# EAGLE schematic DQ542MA ESP32 (EAGLE 9.4.2)
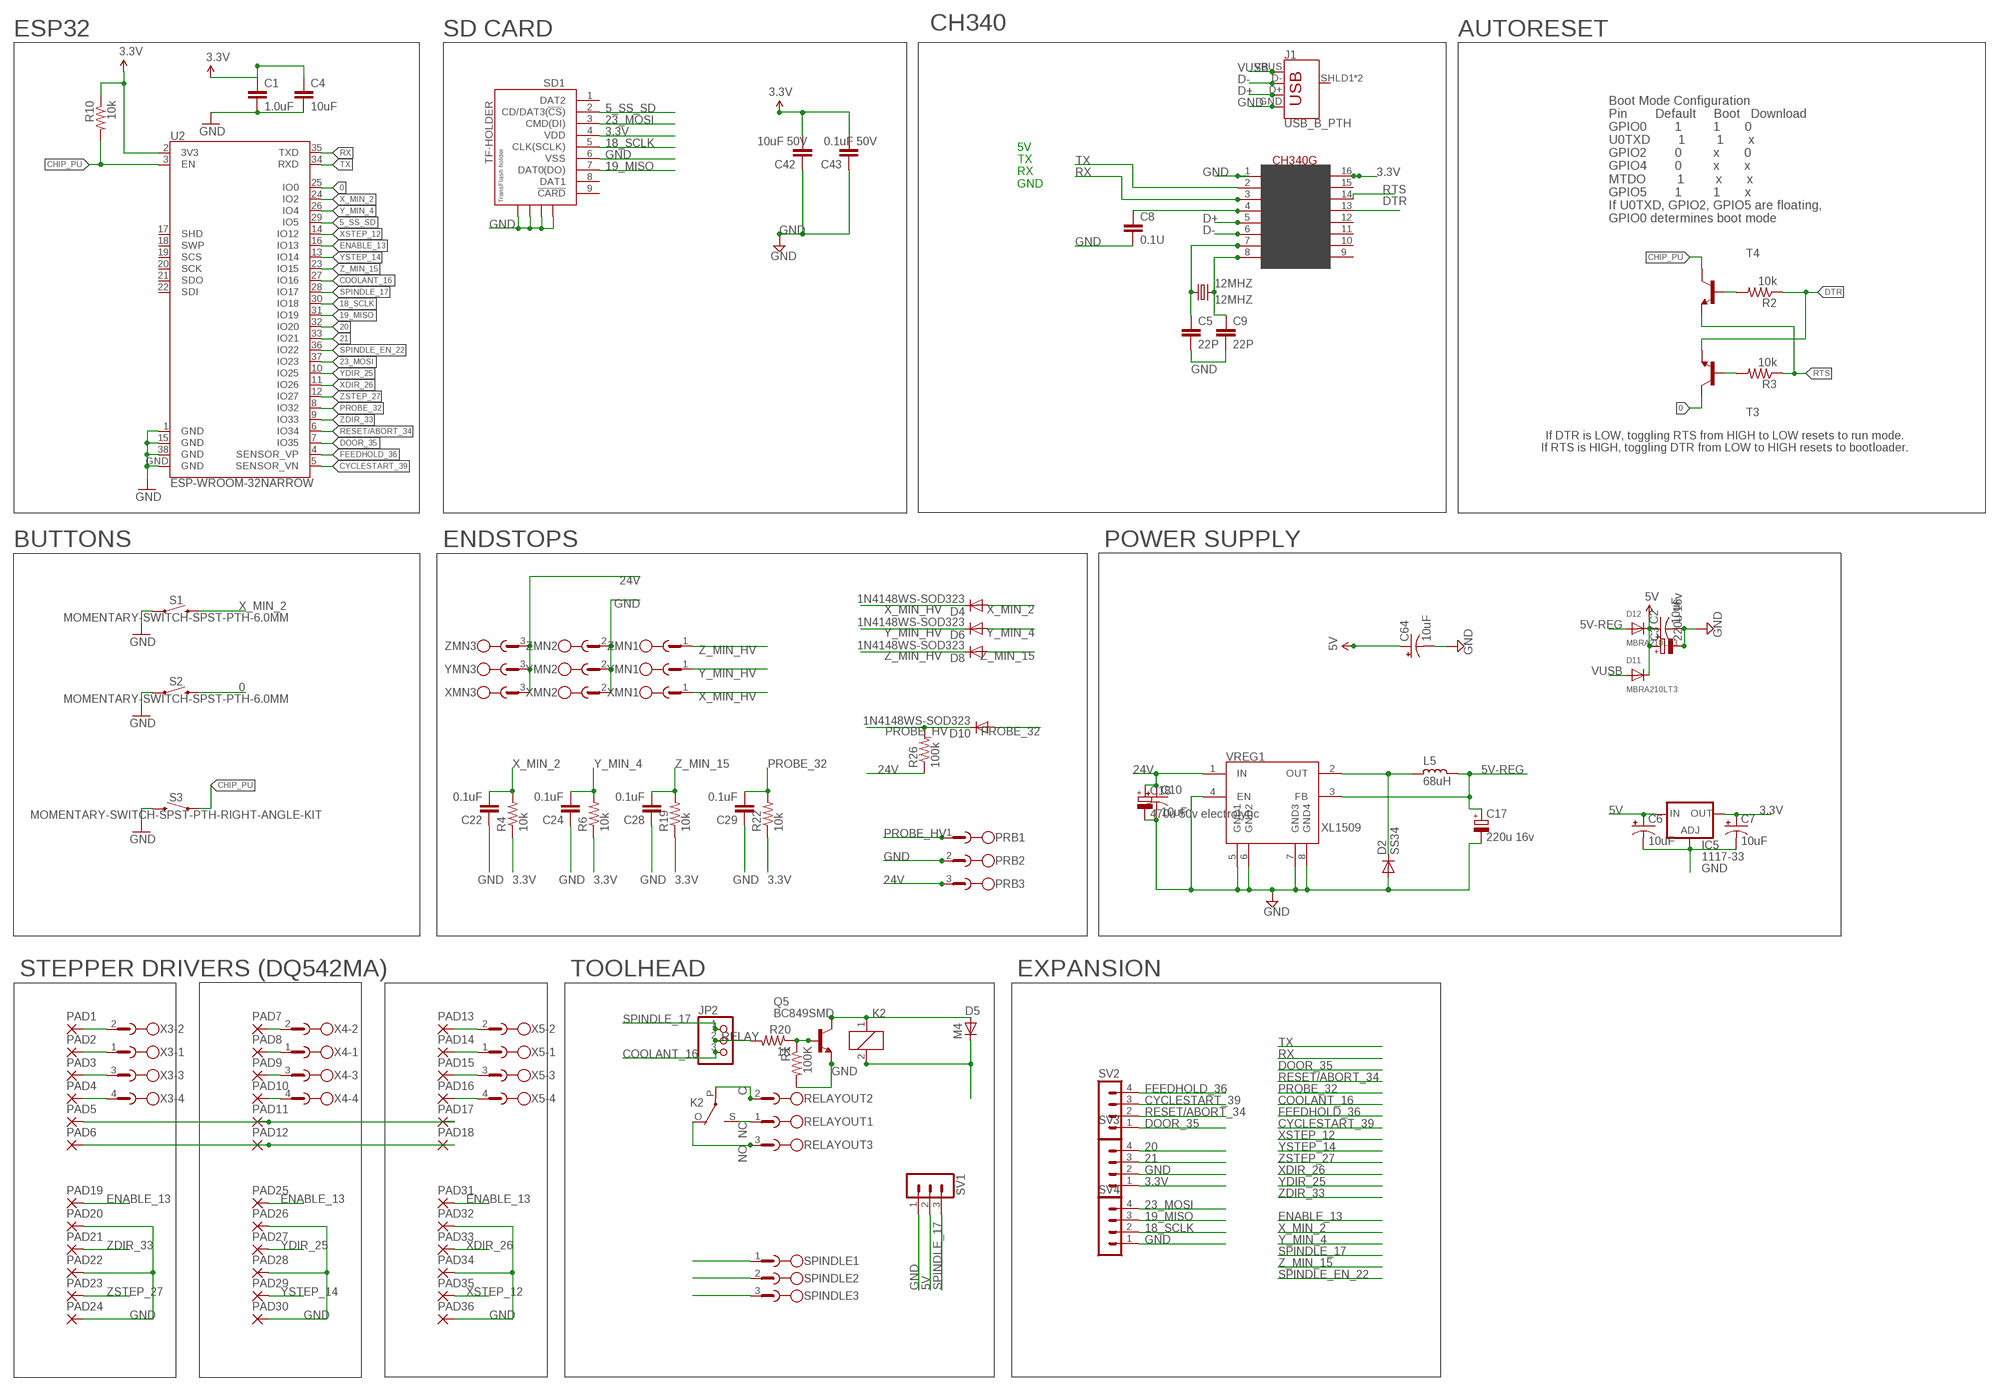
[diagram p0: schematic, sheet 1]

## Parts
12MHZ  12MHZ  CRYSTALHC49U70  [HC49U70]
C1  1.0uF  1.0UF-1206-50V-10%  [1206]
C2  10uF  CAP_POL1206  [EIA3216]
C3  220u 16v  CPOL-EUE3.5-10  [E3,5-10]
C4  10uF  10UF-1206-6.3V-20%  [1206]
C5  22P  C-EUC1206  [C1206]
C6  10uF  CAP_POL1206  [EIA3216]
C7  10uF  CAP_POL1206  [EIA3216]
C8  0.1U  C-EUC1206  [C1206]
C9  22P  C-EUC1206  [C1206]
C10  10uF  CAP_POL1206  [EIA3216]
C17  220u 16v  CPOL-EUE3.5-10  [E3,5-10]
C18  470u 50v electrolytic  CPOL-EUE3.5-10  [E3,5-10]
C22  0.1uF  C-EUC1206  [C1206]
C24  0.1uF  C-EUC1206  [C1206]
C28  0.1uF  C-EUC1206  [C1206]
C29  0.1uF  C-EUC1206  [C1206]
C42  10uF 50V  C-EUC1206  [C1206]
C43  0.1uF 50V  C-EUC0603  [C0603]
C64  10uF  CAP_POL1206  [EIA3216]
D2  SS34  DIODE-DO-214AC  [DO-214AC]
D4  1N4148WS-SOD323  DIODE-SOD80C  [SOD80C]
D5  M4  D-SOD-80  [SOD80]
D6  1N4148WS-SOD323  DIODE-SOD80C  [SOD80C]
D8  1N4148WS-SOD323  DIODE-SOD80C  [SOD80C]
D10  1N4148WS-SOD323  DIODE-SOD80C  [SOD80C]
D11  MBRA210LT3  DIODESMA  [SMADIODE]
D12  MBRA210LT3  DIODESMA  [SMADIODE]
IC5  1117-33  LD117AS33TR  [SOT223]
J1  USB_B_PTH  [USB-B-PTH]
JP2  PINHD-1X3  [1X03]
K2  G5L  [G5LE]
L5  68uH  L_CD75  [CD75]
PAD1  3,81/1,4  [3,81/1,4]
PAD2  3,81/1,4  [3,81/1,4]
PAD3  3,81/1,4  [3,81/1,4]
PAD4  3,81/1,4  [3,81/1,4]
PAD5  3,81/1,4  [3,81/1,4]
PAD6  3,81/1,4  [3,81/1,4]
PAD7  3,81/1,4  [3,81/1,4]
PAD8  3,81/1,4  [3,81/1,4]
PAD9  3,81/1,4  [3,81/1,4]
PAD10  3,81/1,4  [3,81/1,4]
PAD11  3,81/1,4  [3,81/1,4]
PAD12  3,81/1,4  [3,81/1,4]
PAD13  3,81/1,4  [3,81/1,4]
PAD14  3,81/1,4  [3,81/1,4]
PAD15  3,81/1,4  [3,81/1,4]
PAD16  3,81/1,4  [3,81/1,4]
PAD17  3,81/1,4  [3,81/1,4]
PAD18  3,81/1,4  [3,81/1,4]
PAD19  3,81/1,4  [3,81/1,4]
PAD20  3,81/1,4  [3,81/1,4]
PAD21  3,81/1,4  [3,81/1,4]
PAD22  3,81/1,4  [3,81/1,4]
PAD23  3,81/1,4  [3,81/1,4]
PAD24  3,81/1,4  [3,81/1,4]
PAD25  3,81/1,4  [3,81/1,4]
PAD26  3,81/1,4  [3,81/1,4]
PAD27  3,81/1,4  [3,81/1,4]
PAD28  3,81/1,4  [3,81/1,4]
PAD29  3,81/1,4  [3,81/1,4]
PAD30  3,81/1,4  [3,81/1,4]
PAD31  3,81/1,4  [3,81/1,4]
PAD32  3,81/1,4  [3,81/1,4]
PAD33  3,81/1,4  [3,81/1,4]
PAD34  3,81/1,4  [3,81/1,4]
PAD35  3,81/1,4  [3,81/1,4]
PAD36  3,81/1,4  [3,81/1,4]
PRB  Phoenix Pluggable 3.81mm 3 way  MC1.5/3  [MC1.5/3-G-3.81]
Q5  BC849SMD  [SOT23-BEC]
R1  100K  R-US_R1206  [R1206]
R2  10k  R-US_R1206  [R1206]
R3  10k  R-US_R1206  [R1206]
R4  10k  R-US_R1206  [R1206]
R6  10k  R-US_R1206  [R1206]
R10  10k  R-US_R1206  [R1206]
R19  10k  R-US_R1206  [R1206]
R20  1K  R-US_R1206  [R1206]
R22  10k  R-US_R1206  [R1206]
R26  100k  R-US_R1206  [R1206]
RELAYOUT  Phoenix Pluggable 3.81mm 3 way  MC1.5/3  [MC1.5/3-G-3.81]
S1  MOMENTARY-SWITCH-SPST-PTH-6.0MM  [TACTILE_SWITCH_PTH_6.0MM]
S2  MOMENTARY-SWITCH-SPST-PTH-6.0MM  [TACTILE_SWITCH_PTH_6.0MM]
S3  MOMENTARY-SWITCH-SPST-PTH-RIGHT-ANGLE-KIT  [TACTILE_SWITCH_PTH_RIGHT_ANGLE_KIT]
SD1  TF-HOLDER  [TF-PULL]
SPINDLE  Phoenix Pluggable 3.81mm 3 way  MC1.5/3  [MC1.5/3-G-3.81]
SV1  MA03-1  [MA03-1]
SV2  MA04-1  [MA04-1]
SV3  MA04-1  [MA04-1]
SV4  MA04-1  [MA04-1]
T3  MMBT2222ALT1-NPN-SOT23-BEC  [SOT23-BEC]
T4  MMBT2222ALT1-NPN-SOT23-BEC  [SOT23-BEC]
U2  ESP-WROOM-32NARROW  [ESP-WROOM-32-NARROW]
U$2  CH340G  [SOIC16]
VREG1  XL1509  [SO08]
X3  Phoenix Pluggable 3.81mm 4 way  MC1.5/4  [MC1.5/4-G-3.81]
X4  Phoenix Pluggable 3.81mm 4 way  MC1.5/4  [MC1.5/4-G-3.81]
X5  Phoenix Pluggable 3.81mm 4 way  MC1.5/4  [MC1.5/4-G-3.81]
XMN  Phoenix Pluggable 3.81mm 3 way  MC1.5/3  [MC1.5/3-G-3.81]
YMN  Phoenix Pluggable 3.81mm 3 way  MC1.5/3  [MC1.5/3-G-3.81]
ZMN  Phoenix Pluggable 3.81mm 3 way  MC1.5/3  [MC1.5/3-G-3.81]

## Nets
0: S2.3 T3.C U2.25(IO0)
3.3V: C1.1 C4.1 C7.A(+) C42.2 C43.2 IC5.4(OUT) R4.1 R6.1 R10.1 R19.1 R22.1 SD1.4(VDD) SV3.1 U2.2(3V3) U$2.16(VCC)
5_SS_SD: SD1.2(CD/DAT3(!CS!)) U2.29(IO5)
5V: C2.A(+) C3.+ C6.A(+) C64.A(+) D5.1(C) D11.C D12.C IC5.3(IN) K2.2 SV1.2
5V-REG: C17.+ D12.A L5.1 VREG1.3(FB)
18_SCLK: SD1.5(CLK(SCLK)) SV4.2 U2.30(IO18)
19_MISO: SD1.7(DAT0(DO)) SV4.3 U2.31(IO19)
20: SV3.4 U2.32(IO20)
21: SV3.3 U2.33(IO21)
23_MOSI: SD1.3(CMD(DI)) SV4.4 U2.37(IO23)
24V: C10.A(+) C18.+ PAD6.1(P) PAD12.1(P) PAD18.1(P) PRB.3 R26.1 VREG1.1(IN) XMN.3 YMN.3 ZMN.3
C: K2.P(2:P) RELAYOUT.2
CHIP_PU: R10.2 S3.1 T4.C U2.3(EN)
COIL-: D5.2(A) K2.1 Q5.C
COOLANT_16: JP2.3 U2.27(IO16)
CYCLESTART_39: SV2.3 U2.5(SENSOR_VN)
D+: J1.D+ U$2.5(D+)
D-: J1.D- U$2.6(D-)
DOOR_35: SV2.1 U2.7(IO35)
DTR: R2.1 T3.E U$2.13(DTR)
ENABLE_13: PAD19.1(P) PAD25.1(P) PAD31.1(P) U2.16(IO13)
FEEDHOLD_36: SV2.4 U2.4(SENSOR_VP)
GND: C1.2 C2.C(-) C3.- C4.2 C5.2 C6.C(-) C7.C(-) C8.2 C9.2 C10.C(-) C17.- C18.- C22.1 C24.1 C28.1 C29.1 C42.1 C43.1 C64.C(-) D2.2(A) IC5.1(ADJ) J1.GND PAD5.1(P) PAD11.1(P) PAD17.1(P) PAD20.1(P) PAD22.1(P) PAD24.1(P) PAD26.1(P) PAD28.1(P) PAD30.1(P) PAD32.1(P) PAD34.1(P) PAD36.1(P) PRB.2 Q5.E R1.2 S1.1 S2.1 S3.2 SD1.6(VSS) SD1.S1 SD1.S2 SD1.S3 SD1.S4 SPINDLE.1 SV1.1 SV3.2 SV4.1 U2.1(GND) U2.15(GND) U2.38(GND) U2.GND U$2.1(GND) VREG1.4(EN) VREG1.5(GND1) VREG1.6(GND2) VREG1.7(GND3) VREG1.8(GND4) XMN.2 YMN.2 ZMN.2
N$2: R2.2 T4.B
N$3: R3.2 T3.B
N$6: PAD10.1(P) X4.4
N$8: PAD8.1(P) X4.1
N$9: 12MHZ.1 C5.1 U$2.7(XI)
N$10: PAD7.1(P) X4.2
N$11: 12MHZ.2 C9.1 U$2.8(XO)
N$13: PAD2.1(P) X3.1
N$14: PAD1.1(P) X3.2
N$15: PAD14.1(P) X5.1
N$16: PAD13.1(P) X5.2
N$32: PAD4.1(P) X3.4
N$35: PAD3.1(P) X3.3
N$38: PAD9.1(P) X4.3
N$40: PAD16.1(P) X5.4
N$42: Q5.B R1.1 R20.1
N$43: PAD15.1(P) X5.3
N$292: D2.1(C) L5.2 VREG1.2(OUT)
NC: K2.S(2:S) RELAYOUT.1
NO: K2.O(2:O) RELAYOUT.3
PROBE_32: C29.2 D10.A R22.2 U2.8(IO32)
PROBE_HV: D10.C PRB.1 R26.2
RELAY: JP2.2 R20.2
RESET/ABORT_34: SV2.2 U2.6(IO34)
RTS: R3.1 T4.E U$2.14(RTS)
RX: U2.35(TXD) U$2.3(RX)
SPINDLE_17: JP2.1 SPINDLE.2 SV1.3 U2.28(IO17)
SPINDLE_EN_22: SPINDLE.3 U2.36(IO22)
TX: U2.34(RXD) U$2.2(TX)
V3: C8.1 U$2.4(V3)
VUSB: D11.A J1.VBUS
X_MIN_2: C22.2 D4.A R4.2 S1.3 U2.24(IO2)
X_MIN_HV: D4.C XMN.1
XDIR_26: PAD33.1(P) U2.11(IO26)
XSTEP_12: PAD35.1(P) U2.14(IO12)
Y_MIN_4: C24.2 D6.A R6.2 U2.26(IO4)
Y_MIN_HV: D6.C YMN.1
YDIR_25: PAD27.1(P) U2.10(IO25)
YSTEP_14: PAD29.1(P) U2.13(IO14)
Z_MIN_15: C28.2 D8.A R19.2 U2.23(IO15)
Z_MIN_HV: D8.C ZMN.1
ZDIR_33: PAD21.1(P) U2.9(IO33)
ZSTEP_27: PAD23.1(P) U2.12(IO27)
Unconnected: J1.SHLD1(SHIELD) J1.SHLD2(SHIELD) SD1.1(DAT2) SD1.8(DAT1) SD1.9(!CARD) U2.17(SHD) U2.18(SWP) U2.19(SCS) U2.20(SCK) U2.21(SDO) U2.22(SDI) U$2.9(CTS) U$2.10(DSR) U$2.11(RI) U$2.12(DCD) U$2.15(RS232)

## Notes on the sheet
- ESP32 | SD CARD | CH340 | AUTORESET
- 5V
  TX
  RX
  GND
- Boot Mode Configuration
  Pin        Default     Boot   Download
  GPIO0        1         1       0
  U0TXD        1         1       x
  GPIO2        0         x       0
  GPIO4        0         x       x
  MTDO         1         x       x
  GPIO5        1         1       x
  If U0TXD, GPIO2, GPIO5 are floating, 
  GPIO0 determines boot mode
- If DTR is LOW, toggling RTS from HIGH to LOW resets to run mode.
  If RTS is HIGH, toggling DTR from LOW to HIGH resets to bootloader.
- BUTTONS | ENDSTOPS | POWER SUPPLY
- STEPPER DRIVERS (DQ542MA) | TOOLHEAD | EXPANSION

## Library data of the parts
12MHZ = crystal:CRYSTAL: CRYSTAL; OC_FARNELL: unknown; OC_NEWARK: unknown
C1 = SparkFun-Capacitors:1.0UF: 1µF ceramic capacitors A capacitor is a passive two-terminal electrical component used to store electrical energy temporarily in an electric field.; PROD_ID: CAP-09822
C2 C6 C7 C10 C64 = SparkFun:CAP_POL: Capacitor Polarized These are standard SMD and PTH capacitors. Normally 10uF, 47uF, and 100uF in electrolytic and tantalum varieties. Always verify the external diameter of the through hole cap, it varies with capacity, voltage, and manufacturer. The EIA devices should be standard.
C3 C17 C18 = rcl:CPOL-EU: POLARIZED CAPACITOR, European symbol
C4 = SparkFun-Capacitors:10UF: 10.0µF ceramic capacitors A capacitor is a passive two-terminal electrical component used to store electrical energy temporarily in an electric field.; PROD_ID: CAP-10057
C5 C8 C9 C22 C24 C28 C29 = rcl:C-EU: CAPACITOR, European symbol
C42 C43 = resistor:C-EU: CAPACITOR, European symbol
D2 = dp_devices:DIODE: Various Diode Packages
D4 D6 D8 D10 = diode:DIODE-: DIODE
D5 = semicon-smd-ipc:D-: DIODE unfilled
D11 D12 = microbuilder:DIODE: Diode SMADIODE - SMA Surface Mount Package 20V 1A Schottky Diode Digikey (500mV @ 1A, 500uA Vr @ 20V): 641-1014-6-ND 10V 2A Schottky Diode Digikey (350mV @ 2A, 700uA Vr @ 10V): MBRA210LT3 SOD-123 30V 200mA (800mV Vf, 2uA Vr @ 25V) Schottky Diode (very fast switching for boost, etc.) - Digikey: BAT54T1GOSTR-ND 30V 500mA (430mV Vf, 130uA Vr @ 30V) Schottky Diode - Digikey: B0530W-FDICT-ND MBR120 1A 20V (0.34Vf) Schottky Diode - Digikey: MBR120VLSFT1GOSCT-ND SOD-323 10V 570mA (380mV Vf, 3ns) Schottky Diode - Digikey: ZLLS410CT-ND 1N4148WS - 75V 150mA (1V Vf @ 10mA, 4ns) Simple Diode - Digikey: 1N4148WSFSCT-ND, Mouser: 512-1N4148WS SOD-523 BAT54 30V 200mA Schottky (0.8 Vf @ 100mA, 5ns) - Digikey: BAT54XV2CT-ND 30V 30mA Schottky Diode (RB751S-40TE61) - Digikey: RB751S-40TE61CT-ND SOT23-R/W - SOT23 Package (R = Solder Paste/Reflow Ovens, W = Hand-Soldering) BAT54Film 40V 300mA - Digikey: 497-7162-1-ND DO-1N4148 Through Hole Small Current Diode (any model)
IC5 = v-reg:LD117A?*: Low drop fixed and adjustable positive voltage regulators 1 A Source: http://www.st.com/stonline/products/literature/ds/7194/ld1117axx.pdf
J1 = SparkFun-Connectors:USB_B: USB Type B Connector SparkFun Products: SparkFun Stepoko <https://www.sparkfun.com/products/13899> PTH; PROD_ID: CONN-08278; SF_ID: PRT-00139
JP2 = pinhead:PINHD-1X3: PIN HEADER
K2 = relay:G5L: RELAY 1 x switch, 10 A/120 V AC, 8 A/30 V ADC, Omron; OC_FARNELL: unknown; OC_NEWARK: unknown
L5 = rc-master-smd:L_: INDUCTOR
PAD1-PAD36 = wirepad:3,81/1,4: THROUGH-HOLE PAD
PRB RELAYOUT SPINDLE XMN YMN ZMN = jt-con-phoenix-3.81:MC1.5/3: PHOENIX
Q5 = transistor-npn:BC849*: NPN Transistor
R1 R10 R20 = adafruit:R-US_: RESISTOR, American symbol
R2-R4 R6 R19 R22 R26 = resistor:R-US_: RESISTOR, American symbol
S1 S2 = SparkFun-Switches:MOMENTARY-SWITCH-SPST: Momentary Switch (Pushbutton) - SPST Normally-open (NO) SPST momentary switches (buttons, pushbuttons). Variants PTH-12MM - 12mm square, through-hole Momentary Pushbutton Switch - 12mm Square <https://www.sparkfun.com/products/9190> (COM-09190) PTH-6.0MM, PTH-6.0MM-KIT - 6.0mm square, through-hole Mini Pushbutton Switch <https://www.sparkfun.com/products/97> (COM-00097) KIT package intended for soldering kit's - only one side of pads' copper is exposed. PTH-RIGHT-ANGLE-KIT - Right-angle, through-hole Right Angle Tactile Button <https://www.sparkfun.com/products/10791> - Used on SparkFun BigTime Watch Kit <https://www.sparkfun.com/products/11734> SMD-12MM - 12mm square, surface-mount Tactile Button - SMD (12mm) <https://www.sparkfun.com/products/12993> (COM-12993) Used on SparkFun PicoBoard <https://www.sparkfun.com/products/11888> SMD-4.5MM - 4.5mm Square Trackball Switch Used on SparkFun Blackberry Trackballer Breakout <https://www.sparkfun.com/products/13169> SMD-4.6MMX2.8MM - 4.60mm x 2.80mm, surface mount Used on SparkFun SAMD21 Mini Breakout <https://www.sparkfun.com/products/13664> SMD-5.2MM, SMD-5.2-REDUNDANT - 5.2mm square, surface-mount Mini Pushbutton Switch - SMD <https://www.sparkfun.com/products/8720> (COM-08720) Used on Arduino Pro Mini <https://www.sparkfun.com/products/11114> REDUNDANT package connects both switch circuits together SMD-6.0X3.5MM - 6.0 x 3.5mm, surface mount Momentary Reset Switch SMD <https://www.sparkfun.com/products/8229> (COM-08229) SMD-6.2MM-TALL - 6.2mm square, surface mount Tactile Button - SMD (6mm) <https://www.sparkfun.com/products/12992> Used on SparkFun Digital Sandbox <https://www.sparkfun.com/products/12651> SMD-RIGHT-ANGLE - Right-angle, surface mount Used on SparkFun Block for Intel® Edison - Arduino <https://www.sparkfun.com/products/13036>; PROD_ID: SWCH-08441; SF_SKU: COM-00097
S3 = SparkFun-Switches:MOMENTARY-SWITCH-SPST: Momentary Switch (Pushbutton) - SPST Normally-open (NO) SPST momentary switches (buttons, pushbuttons). Variants PTH-12MM - 12mm square, through-hole Momentary Pushbutton Switch - 12mm Square <https://www.sparkfun.com/products/9190> (COM-09190) PTH-6.0MM, PTH-6.0MM-KIT - 6.0mm square, through-hole Mini Pushbutton Switch <https://www.sparkfun.com/products/97> (COM-00097) KIT package intended for soldering kit's - only one side of pads' copper is exposed. PTH-RIGHT-ANGLE-KIT - Right-angle, through-hole Right Angle Tactile Button <https://www.sparkfun.com/products/10791> - Used on SparkFun BigTime Watch Kit <https://www.sparkfun.com/products/11734> SMD-12MM - 12mm square, surface-mount Tactile Button - SMD (12mm) <https://www.sparkfun.com/products/12993> (COM-12993) Used on SparkFun PicoBoard <https://www.sparkfun.com/products/11888> SMD-4.5MM - 4.5mm Square Trackball Switch Used on SparkFun Blackberry Trackballer Breakout <https://www.sparkfun.com/products/13169> SMD-4.6MMX2.8MM - 4.60mm x 2.80mm, surface mount Used on SparkFun SAMD21 Mini Breakout <https://www.sparkfun.com/products/13664> SMD-5.2MM, SMD-5.2-REDUNDANT - 5.2mm square, surface-mount Mini Pushbutton Switch - SMD <https://www.sparkfun.com/products/8720> (COM-08720) Used on Arduino Pro Mini <https://www.sparkfun.com/products/11114> REDUNDANT package connects both switch circuits together SMD-6.0X3.5MM - 6.0 x 3.5mm, surface mount Momentary Reset Switch SMD <https://www.sparkfun.com/products/8229> (COM-08229) SMD-6.2MM-TALL - 6.2mm square, surface mount Tactile Button - SMD (6mm) <https://www.sparkfun.com/products/12992> Used on SparkFun Digital Sandbox <https://www.sparkfun.com/products/12651> SMD-RIGHT-ANGLE - Right-angle, surface mount Used on SparkFun Block for Intel® Edison - Arduino <https://www.sparkfun.com/products/13036>; PROD_ID: CONN-10672; SF_SKU: COM-10791
SD1 = sd-mmc:TF-HOLDER: TF / Micro SD socket is PUSH-PUSH type, the card can be pushed into and auto locked and pushed out by simply press the card. Surface Mounting type.
SV1 = con-lstb:MA03-1: PIN HEADER; OC_FARNELL: unknown; OC_NEWARK: unknown
SV2-SV4 = con-lstb:MA04-1: PIN HEADER; OC_FARNELL: unknown; OC_NEWARK: unknown
T3 T4 = transistor:*-NPN-: NPN Transistror BF959 corrected 2008.03.06
U2 = SparkFun-RF:ESP-WROOM-32; PROD_ID: IC-13849
U$2 = usb-serial:CH340G
VREG1 = Cohesion_parts:XL1509
X3-X5 = jt-con-phoenix-3.81:MC1.5/4: PHOENIX

## Net classes
1 power: width 0.6 mm, clearance 0.305 mm
5 3.3-Amp Class: width 1.27 mm